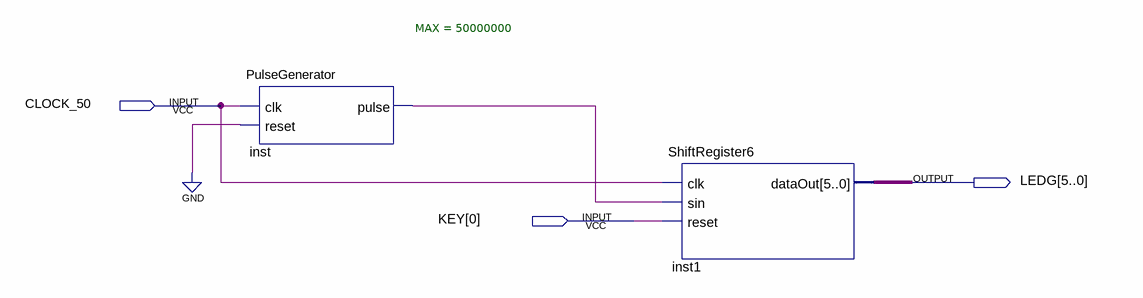
[diagram p0: schematic sheet]
// Quartus schematic implementation.bdf as structural Verilog: 2 symbols, 3 pins
module implementation (
  input  CLOCK_50,
  input  [0:0] KEY,
  output [5:0] LEDG
);

  wire inst_pulse;

  PulseGenerator #(.MAX(50000000)) inst (.clk(CLOCK_50), .reset(1'b0), .pulse(inst_pulse));
  ShiftRegister6 inst1 (.clk(CLOCK_50), .sin(inst_pulse), .reset(KEY[0]), .dataOut(LEDG));
endmodule
